# Altium schematic sheet matrix_8x8_ws2812_LEDs.SchDoc
size A; Organization: Machine Intelligence Laboratory; Address1: 1889 Museum Rd; Address2: Room 3001; Address3: Gainesville, FL, 32611; SheetNumber: 1; SheetTotal: 2
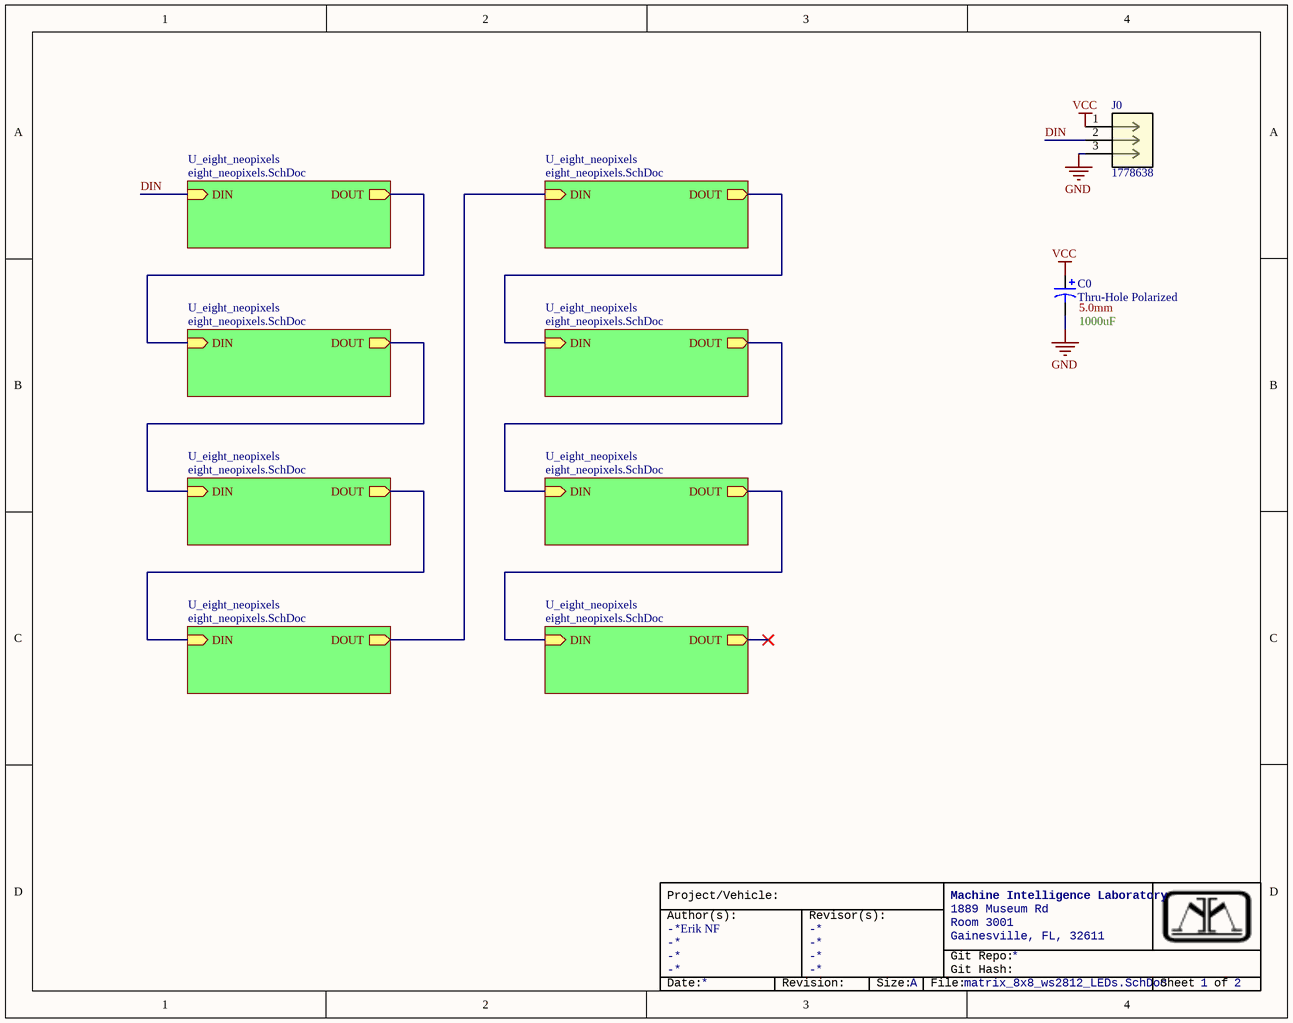
[diagram p0: matrix_8x8_ws2812_LEDs.SchDoc]

## Parts
C0  Thru-Hole Polarized  Pin Spacing: 5.0mm  Capacitance: 1000uF  [[Cap] Thru-Hole Polarized 3.5mm]
J0  1778638  [CONN_1814854]

## Sub-sheets
U_eight_neopixels = eight_neopixels.SchDoc: DIN (in), DOUT (out)
U_eight_neopixels = eight_neopixels.SchDoc: DIN (in), DOUT (out)
U_eight_neopixels = eight_neopixels.SchDoc: DIN (in), DOUT (out)
U_eight_neopixels = eight_neopixels.SchDoc: DIN (in), DOUT (out)
U_eight_neopixels = eight_neopixels.SchDoc: DIN (in), DOUT (out)
U_eight_neopixels = eight_neopixels.SchDoc: DIN (in), DOUT (out)
U_eight_neopixels = eight_neopixels.SchDoc: DIN (in), DOUT (out)
U_eight_neopixels = eight_neopixels.SchDoc: DIN (in), DOUT (out)

## Nets
GND: C0.2 J0.3
VCC: C0.1 J0.1
DIN: J0.2 ; sheet U_eight_neopixels/DIN
(unnamed): sheet U_eight_neopixels/DOUT, sheet U_eight_neopixels/DIN
(unnamed): sheet U_eight_neopixels/DOUT, sheet U_eight_neopixels/DIN
(unnamed): sheet U_eight_neopixels/DOUT, sheet U_eight_neopixels/DIN
(unnamed): sheet U_eight_neopixels/DOUT, sheet U_eight_neopixels/DIN
(unnamed): sheet U_eight_neopixels/DOUT, sheet U_eight_neopixels/DIN
(unnamed): sheet U_eight_neopixels/DOUT, sheet U_eight_neopixels/DIN
(unnamed): sheet U_eight_neopixels/DOUT, sheet U_eight_neopixels/DIN

## Notes on the sheet
- Erik NF
- Project/Vehicle:
- Author(s):
- -
- Revisor(s):
- Git Repo:
- Git Hash:
- Date:
- Revision:
- Size:
- A
- File:
- Sheet
- of

## Library data of the parts
C0 = [Cap] Thru-Hole Polarized: Tolerance: 20%; Voltage: 10V
J0 = 1778638: PCB headers, nominal cross section: 0.5 mmÂ², color: black, nominal current: 6 A, rated voltage (III/2): 160 V, contact surface: Tin, contact connection type: Pin, number of potentials: 3, number of rows: 1, number of positions: 3, number of connections: 3, product range: PTSM 0,5/..-HH-THR, pitch: 2.5 mm, mounting: THR soldering, pin layout: Linear pinning, solder pin [P]: 2.1 mm, number of solder pins per potential: 1, plug-in system: COMBICON PTSM, Pin connector pattern alignment: Standard, locking: without, mounting: without, type of packaging: 32 mm wide tape; Manufacturer_Name: Phoenix Contact; Copyright: Copyright (C) 2025 Ultra Librarian. All rights reserved.; Manufacturer_Part_Number: 1778638; RefDes: RefDes; Type: Type